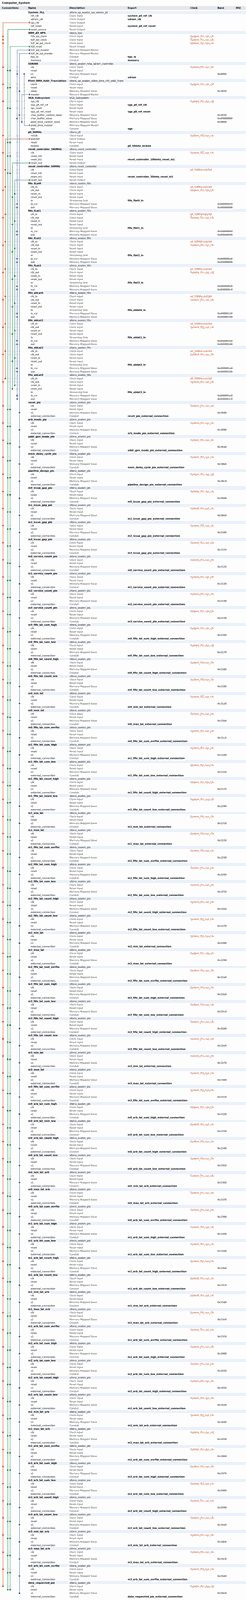
[diagram p0: system contents, whole]
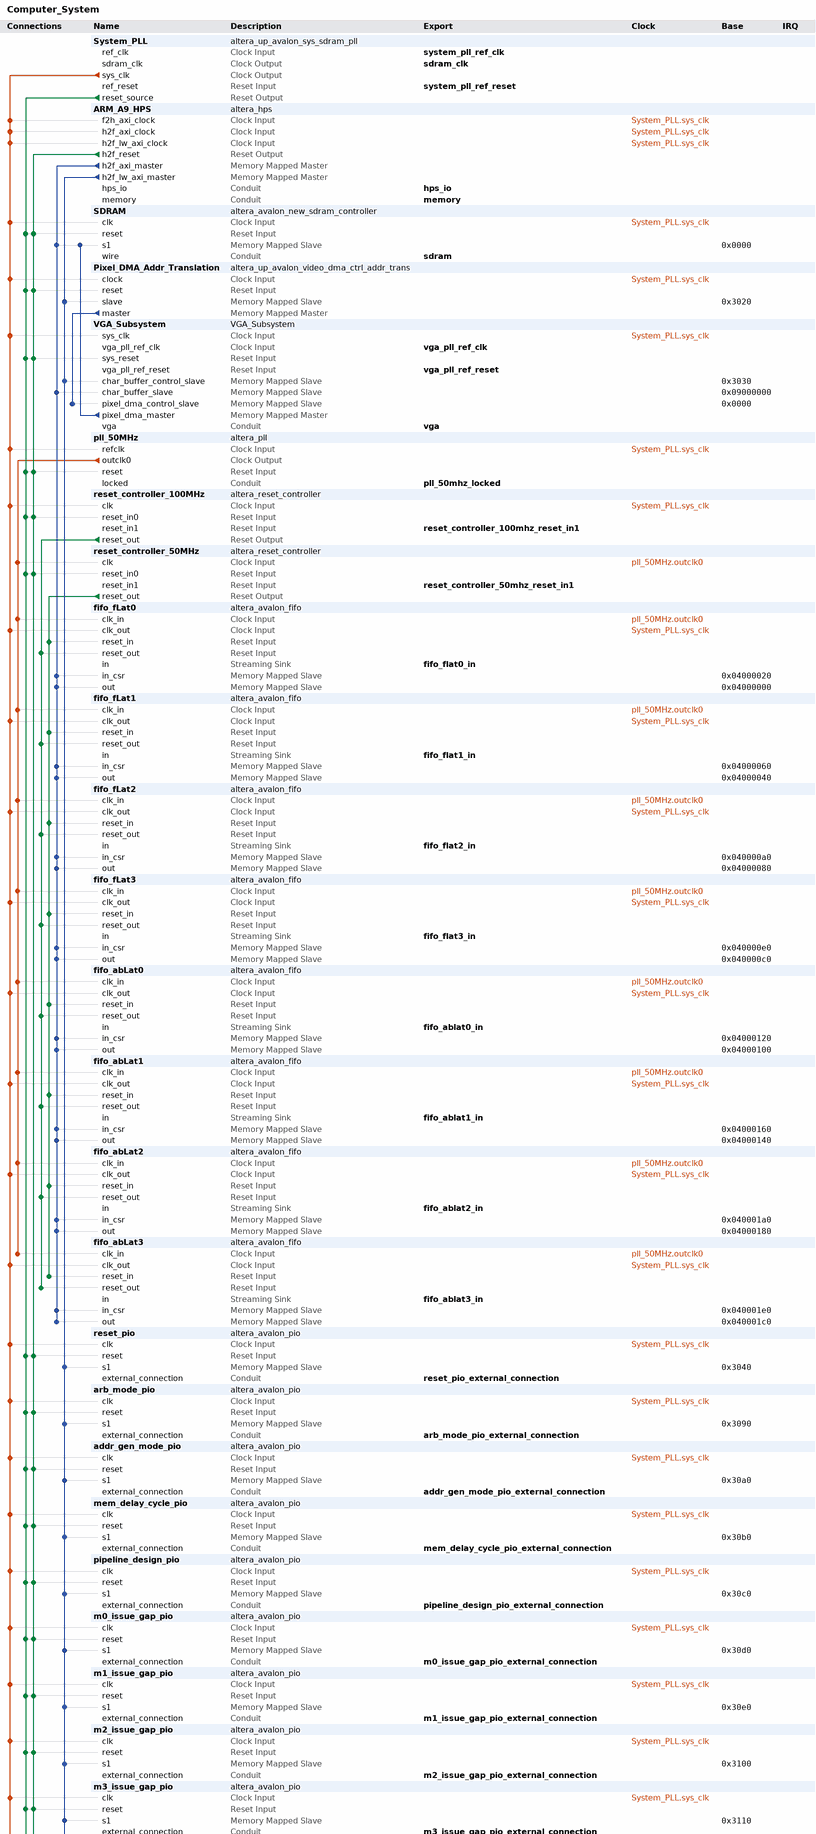
[diagram p1: system contents, upper part]
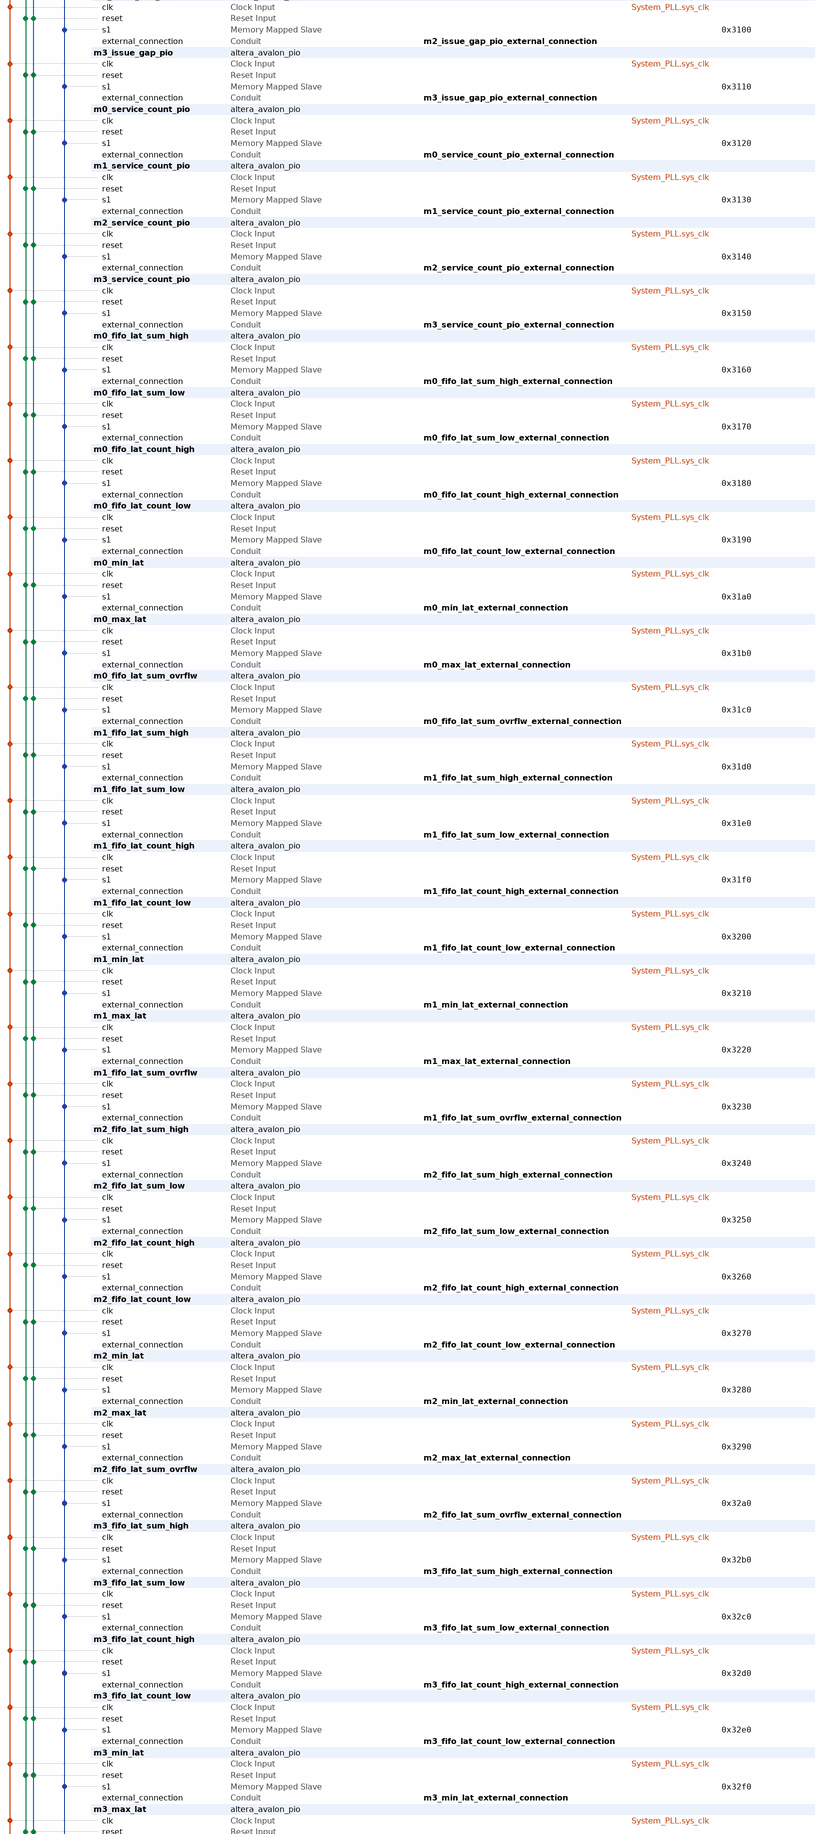
[diagram p2: system contents, middle part]
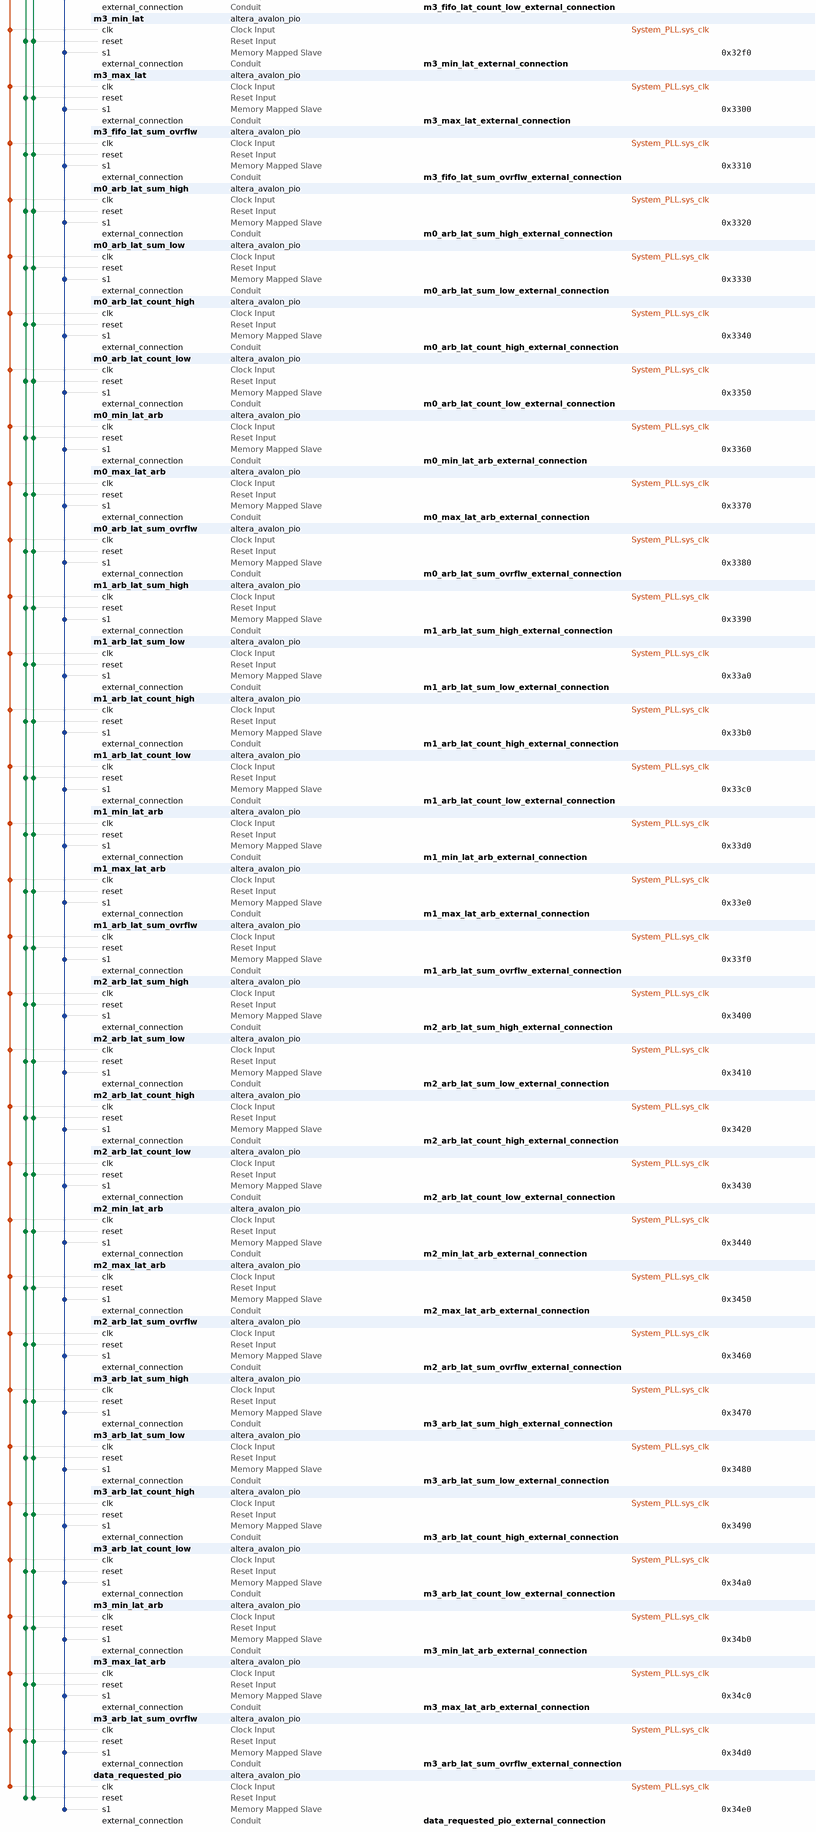
[diagram p3: system contents, lower part]
# Platform Designer (Qsys) system Computer_System, Cyclone V 5CSEMA5F31C6
# Parameters at their usual value, and those the tool derives, are not listed.
package require -exact qsys 18.1
create_system Computer_System
set_project_property DEVICE_FAMILY {Cyclone V}
set_project_property DEVICE 5CSEMA5F31C6

add_instance System_PLL altera_up_avalon_sys_sdram_pll 18.0
set_instance_parameter_value System_PLL CV_boards DE1-SoC
set_instance_parameter_value System_PLL gui_outclk 100.0
set_instance_parameter_value System_PLL gui_refclk 50.0

add_instance ARM_A9_HPS altera_hps 18.1
set_instance_parameter_value ARM_A9_HPS EMAC1_Mode RGMII
set_instance_parameter_value ARM_A9_HPS EMAC1_PinMuxing {HPS I/O Set 0}
set_instance_parameter_value ARM_A9_HPS F2SCLK_COLDRST_Enable false
set_instance_parameter_value ARM_A9_HPS F2SCLK_DBGRST_Enable false
set_instance_parameter_value ARM_A9_HPS F2SCLK_WARMRST_Enable false
set_instance_parameter_value ARM_A9_HPS F2SINTERRUPT_Enable true
set_instance_parameter_value ARM_A9_HPS F2S_Width 2
set_instance_parameter_value ARM_A9_HPS FPGA_PERIPHERAL_OUTPUT_CLOCK_FREQ_EMAC0_GTX_CLK 125
set_instance_parameter_value ARM_A9_HPS FPGA_PERIPHERAL_OUTPUT_CLOCK_FREQ_EMAC0_MD_CLK 100.0
set_instance_parameter_value ARM_A9_HPS FPGA_PERIPHERAL_OUTPUT_CLOCK_FREQ_EMAC1_GTX_CLK 125
set_instance_parameter_value ARM_A9_HPS FPGA_PERIPHERAL_OUTPUT_CLOCK_FREQ_EMAC1_MD_CLK 100.0
set_instance_parameter_value ARM_A9_HPS HPS_PROTOCOL DDR3
set_instance_parameter_value ARM_A9_HPS I2C0_Mode I2C
set_instance_parameter_value ARM_A9_HPS I2C0_PinMuxing {HPS I/O Set 0}
set_instance_parameter_value ARM_A9_HPS I2C1_Mode I2C
set_instance_parameter_value ARM_A9_HPS I2C1_PinMuxing {HPS I/O Set 0}
set_instance_parameter_value ARM_A9_HPS LWH2F_Enable true
set_instance_parameter_value ARM_A9_HPS MEM_BANKADDR_WIDTH 3
set_instance_parameter_value ARM_A9_HPS MEM_CLK_FREQ 400.0
set_instance_parameter_value ARM_A9_HPS MEM_COL_ADDR_WIDTH 10
set_instance_parameter_value ARM_A9_HPS MEM_DQ_WIDTH 32
set_instance_parameter_value ARM_A9_HPS MEM_DRV_STR RZQ/7
set_instance_parameter_value ARM_A9_HPS MEM_ROW_ADDR_WIDTH 15
set_instance_parameter_value ARM_A9_HPS MEM_RTT_NOM RZQ/4
set_instance_parameter_value ARM_A9_HPS MEM_RTT_WR RZQ/4
set_instance_parameter_value ARM_A9_HPS MEM_TCL 11
set_instance_parameter_value ARM_A9_HPS MEM_TFAW_NS 30.0
set_instance_parameter_value ARM_A9_HPS MEM_TRAS_NS 35.0
set_instance_parameter_value ARM_A9_HPS MEM_TRCD_NS 13.75
set_instance_parameter_value ARM_A9_HPS MEM_TRFC_NS 260.0
set_instance_parameter_value ARM_A9_HPS MEM_TRP_NS 13.75
set_instance_parameter_value ARM_A9_HPS MEM_VENDOR JEDEC
set_instance_parameter_value ARM_A9_HPS MEM_WTCL 8
set_instance_parameter_value ARM_A9_HPS QSPI_Mode {1 SS}
set_instance_parameter_value ARM_A9_HPS QSPI_PinMuxing {HPS I/O Set 0}
set_instance_parameter_value ARM_A9_HPS REF_CLK_FREQ 25.0
set_instance_parameter_value ARM_A9_HPS S2FCLK_USER2CLK 5
set_instance_parameter_value ARM_A9_HPS S2F_Width 3
set_instance_parameter_value ARM_A9_HPS SDIO_Mode {4-bit Data}
set_instance_parameter_value ARM_A9_HPS SDIO_PinMuxing {HPS I/O Set 0}
set_instance_parameter_value ARM_A9_HPS SPIM1_Mode {Single Slave Select}
set_instance_parameter_value ARM_A9_HPS SPIM1_PinMuxing {HPS I/O Set 0}
set_instance_parameter_value ARM_A9_HPS STM_Enable false
set_instance_parameter_value ARM_A9_HPS TIMING_BOARD_AC_SKEW 0.03
set_instance_parameter_value ARM_A9_HPS TIMING_BOARD_AC_TO_CK_SKEW 0.0
set_instance_parameter_value ARM_A9_HPS TIMING_BOARD_DQ_TO_DQS_SKEW 0.0
set_instance_parameter_value ARM_A9_HPS TIMING_BOARD_MAX_CK_DELAY 0.03
set_instance_parameter_value ARM_A9_HPS TIMING_BOARD_MAX_DQS_DELAY 0.02
set_instance_parameter_value ARM_A9_HPS TIMING_BOARD_SKEW_BETWEEN_DQS 0.08
set_instance_parameter_value ARM_A9_HPS TIMING_BOARD_SKEW_CKDQS_DIMM_MAX 0.16
set_instance_parameter_value ARM_A9_HPS TIMING_BOARD_SKEW_CKDQS_DIMM_MIN 0.09
set_instance_parameter_value ARM_A9_HPS TIMING_BOARD_SKEW_WITHIN_DQS 0.01
set_instance_parameter_value ARM_A9_HPS TIMING_TDH 65
set_instance_parameter_value ARM_A9_HPS TIMING_TDQSCK 255
set_instance_parameter_value ARM_A9_HPS TIMING_TDQSQ 125
set_instance_parameter_value ARM_A9_HPS TIMING_TDS 30
set_instance_parameter_value ARM_A9_HPS TIMING_TIH 140
set_instance_parameter_value ARM_A9_HPS TIMING_TIS 180
set_instance_parameter_value ARM_A9_HPS TIMING_TQSH 0.4
set_instance_parameter_value ARM_A9_HPS UART0_Mode {No Flow Control}
set_instance_parameter_value ARM_A9_HPS UART0_PinMuxing {HPS I/O Set 0}
set_instance_parameter_value ARM_A9_HPS USB1_Mode SDR
set_instance_parameter_value ARM_A9_HPS USB1_PinMuxing {HPS I/O Set 0}
set_instance_parameter_value ARM_A9_HPS desired_cfg_clk_mhz 100.0
set_instance_parameter_value ARM_A9_HPS desired_qspi_clk_mhz 400.0

add_instance SDRAM altera_avalon_new_sdram_controller 18.1
set_instance_parameter_value SDRAM TAC 5.5
set_instance_parameter_value SDRAM TRCD 20.0
set_instance_parameter_value SDRAM TRP 20.0
set_instance_parameter_value SDRAM casLatency 3
set_instance_parameter_value SDRAM columnWidth 10
set_instance_parameter_value SDRAM dataWidth 16
set_instance_parameter_value SDRAM generateSimulationModel true
set_instance_parameter_value SDRAM model single_Micron_MT48LC4M32B2_7_chip
set_instance_parameter_value SDRAM numberOfBanks 4
set_instance_parameter_value SDRAM numberOfChipSelects 1
set_instance_parameter_value SDRAM powerUpDelay 100.0
set_instance_parameter_value SDRAM refreshPeriod 15.625
set_instance_parameter_value SDRAM rowWidth 13

add_instance Pixel_DMA_Addr_Translation altera_up_avalon_video_dma_ctrl_addr_trans 18.0

add_instance VGA_Subsystem VGA_Subsystem 1.0

add_instance pll_50MHz altera_pll 18.1
set_instance_parameter_value pll_50MHz gui_device_speed_grade 1
set_instance_parameter_value pll_50MHz gui_number_of_clocks 1
set_instance_parameter_value pll_50MHz gui_operation_mode direct
set_instance_parameter_value pll_50MHz gui_output_clock_frequency0 50.0
set_instance_parameter_value pll_50MHz gui_pll_mode {Integer-N PLL}
set_instance_parameter_value pll_50MHz gui_reference_clock_frequency 100.0
set_instance_parameter_value pll_50MHz gui_use_locked true

add_instance reset_controller_100MHz altera_reset_controller 18.1
set_instance_parameter_value reset_controller_100MHz NUM_RESET_INPUTS 2
set_instance_parameter_value reset_controller_100MHz SYNC_DEPTH 2

add_instance reset_controller_50MHz altera_reset_controller 18.1
set_instance_parameter_value reset_controller_50MHz NUM_RESET_INPUTS 2
set_instance_parameter_value reset_controller_50MHz SYNC_DEPTH 2

add_instance fifo_fLat0 altera_avalon_fifo 18.1
set_instance_parameter_value fifo_fLat0 bitsPerSymbol 32
set_instance_parameter_value fifo_fLat0 channelWidth 0
set_instance_parameter_value fifo_fLat0 errorWidth 0
set_instance_parameter_value fifo_fLat0 fifoDepth 4096
set_instance_parameter_value fifo_fLat0 fifoInputInterfaceOptions AVALONST_SINK
set_instance_parameter_value fifo_fLat0 fifoOutputInterfaceOptions AVALONMM_READ
set_instance_parameter_value fifo_fLat0 singleClockMode false
set_instance_parameter_value fifo_fLat0 symbolsPerBeat 1
set_instance_parameter_value fifo_fLat0 useBackpressure false
set_instance_parameter_value fifo_fLat0 useIRQ false
set_instance_parameter_value fifo_fLat0 usePacket false
set_instance_parameter_value fifo_fLat0 useReadControl false

add_instance fifo_fLat1 altera_avalon_fifo 18.1
set_instance_parameter_value fifo_fLat1 bitsPerSymbol 32
set_instance_parameter_value fifo_fLat1 channelWidth 0
set_instance_parameter_value fifo_fLat1 errorWidth 0
set_instance_parameter_value fifo_fLat1 fifoDepth 4096
set_instance_parameter_value fifo_fLat1 fifoInputInterfaceOptions AVALONST_SINK
set_instance_parameter_value fifo_fLat1 fifoOutputInterfaceOptions AVALONMM_READ
set_instance_parameter_value fifo_fLat1 singleClockMode false
set_instance_parameter_value fifo_fLat1 symbolsPerBeat 1
set_instance_parameter_value fifo_fLat1 useBackpressure false
set_instance_parameter_value fifo_fLat1 useIRQ false
set_instance_parameter_value fifo_fLat1 usePacket false
set_instance_parameter_value fifo_fLat1 useReadControl false

add_instance fifo_fLat2 altera_avalon_fifo 18.1
set_instance_parameter_value fifo_fLat2 bitsPerSymbol 32
set_instance_parameter_value fifo_fLat2 channelWidth 0
set_instance_parameter_value fifo_fLat2 errorWidth 0
set_instance_parameter_value fifo_fLat2 fifoDepth 4096
set_instance_parameter_value fifo_fLat2 fifoInputInterfaceOptions AVALONST_SINK
set_instance_parameter_value fifo_fLat2 fifoOutputInterfaceOptions AVALONMM_READ
set_instance_parameter_value fifo_fLat2 singleClockMode false
set_instance_parameter_value fifo_fLat2 symbolsPerBeat 1
set_instance_parameter_value fifo_fLat2 useBackpressure false
set_instance_parameter_value fifo_fLat2 useIRQ false
set_instance_parameter_value fifo_fLat2 usePacket false
set_instance_parameter_value fifo_fLat2 useReadControl false

add_instance fifo_fLat3 altera_avalon_fifo 18.1
set_instance_parameter_value fifo_fLat3 bitsPerSymbol 32
set_instance_parameter_value fifo_fLat3 channelWidth 0
set_instance_parameter_value fifo_fLat3 errorWidth 0
set_instance_parameter_value fifo_fLat3 fifoDepth 4096
set_instance_parameter_value fifo_fLat3 fifoInputInterfaceOptions AVALONST_SINK
set_instance_parameter_value fifo_fLat3 fifoOutputInterfaceOptions AVALONMM_READ
set_instance_parameter_value fifo_fLat3 singleClockMode false
set_instance_parameter_value fifo_fLat3 symbolsPerBeat 1
set_instance_parameter_value fifo_fLat3 useBackpressure false
set_instance_parameter_value fifo_fLat3 useIRQ false
set_instance_parameter_value fifo_fLat3 usePacket false
set_instance_parameter_value fifo_fLat3 useReadControl false

add_instance fifo_abLat0 altera_avalon_fifo 18.1
set_instance_parameter_value fifo_abLat0 bitsPerSymbol 32
set_instance_parameter_value fifo_abLat0 channelWidth 0
set_instance_parameter_value fifo_abLat0 errorWidth 0
set_instance_parameter_value fifo_abLat0 fifoDepth 4096
set_instance_parameter_value fifo_abLat0 fifoInputInterfaceOptions AVALONST_SINK
set_instance_parameter_value fifo_abLat0 fifoOutputInterfaceOptions AVALONMM_READ
set_instance_parameter_value fifo_abLat0 singleClockMode false
set_instance_parameter_value fifo_abLat0 symbolsPerBeat 1
set_instance_parameter_value fifo_abLat0 useBackpressure false
set_instance_parameter_value fifo_abLat0 useIRQ false
set_instance_parameter_value fifo_abLat0 usePacket false
set_instance_parameter_value fifo_abLat0 useReadControl false

add_instance fifo_abLat1 altera_avalon_fifo 18.1
set_instance_parameter_value fifo_abLat1 bitsPerSymbol 32
set_instance_parameter_value fifo_abLat1 channelWidth 0
set_instance_parameter_value fifo_abLat1 errorWidth 0
set_instance_parameter_value fifo_abLat1 fifoDepth 4096
set_instance_parameter_value fifo_abLat1 fifoInputInterfaceOptions AVALONST_SINK
set_instance_parameter_value fifo_abLat1 fifoOutputInterfaceOptions AVALONMM_READ
set_instance_parameter_value fifo_abLat1 singleClockMode false
set_instance_parameter_value fifo_abLat1 symbolsPerBeat 1
set_instance_parameter_value fifo_abLat1 useBackpressure false
set_instance_parameter_value fifo_abLat1 useIRQ false
set_instance_parameter_value fifo_abLat1 usePacket false
set_instance_parameter_value fifo_abLat1 useReadControl false

add_instance fifo_abLat2 altera_avalon_fifo 18.1
set_instance_parameter_value fifo_abLat2 bitsPerSymbol 32
set_instance_parameter_value fifo_abLat2 channelWidth 0
set_instance_parameter_value fifo_abLat2 errorWidth 0
set_instance_parameter_value fifo_abLat2 fifoDepth 4096
set_instance_parameter_value fifo_abLat2 fifoInputInterfaceOptions AVALONST_SINK
set_instance_parameter_value fifo_abLat2 fifoOutputInterfaceOptions AVALONMM_READ
set_instance_parameter_value fifo_abLat2 singleClockMode false
set_instance_parameter_value fifo_abLat2 symbolsPerBeat 1
set_instance_parameter_value fifo_abLat2 useBackpressure false
set_instance_parameter_value fifo_abLat2 useIRQ false
set_instance_parameter_value fifo_abLat2 usePacket false
set_instance_parameter_value fifo_abLat2 useReadControl false

add_instance fifo_abLat3 altera_avalon_fifo 18.1
set_instance_parameter_value fifo_abLat3 bitsPerSymbol 32
set_instance_parameter_value fifo_abLat3 channelWidth 0
set_instance_parameter_value fifo_abLat3 errorWidth 0
set_instance_parameter_value fifo_abLat3 fifoDepth 4096
set_instance_parameter_value fifo_abLat3 fifoInputInterfaceOptions AVALONST_SINK
set_instance_parameter_value fifo_abLat3 fifoOutputInterfaceOptions AVALONMM_READ
set_instance_parameter_value fifo_abLat3 singleClockMode false
set_instance_parameter_value fifo_abLat3 symbolsPerBeat 1
set_instance_parameter_value fifo_abLat3 useBackpressure false
set_instance_parameter_value fifo_abLat3 useIRQ false
set_instance_parameter_value fifo_abLat3 usePacket false
set_instance_parameter_value fifo_abLat3 useReadControl false

add_instance reset_pio altera_avalon_pio 18.1
set_instance_parameter_value reset_pio direction Output
set_instance_parameter_value reset_pio width 32

add_instance arb_mode_pio altera_avalon_pio 18.1
set_instance_parameter_value arb_mode_pio direction Output
set_instance_parameter_value arb_mode_pio width 32

add_instance addr_gen_mode_pio altera_avalon_pio 18.1
set_instance_parameter_value addr_gen_mode_pio direction Output
set_instance_parameter_value addr_gen_mode_pio width 32

add_instance mem_delay_cycle_pio altera_avalon_pio 18.1
set_instance_parameter_value mem_delay_cycle_pio direction Output
set_instance_parameter_value mem_delay_cycle_pio width 32

add_instance pipeline_design_pio altera_avalon_pio 18.1
set_instance_parameter_value pipeline_design_pio direction Output
set_instance_parameter_value pipeline_design_pio width 32

add_instance m0_issue_gap_pio altera_avalon_pio 18.1
set_instance_parameter_value m0_issue_gap_pio direction Output
set_instance_parameter_value m0_issue_gap_pio width 32

add_instance m1_issue_gap_pio altera_avalon_pio 18.1
set_instance_parameter_value m1_issue_gap_pio direction Output
set_instance_parameter_value m1_issue_gap_pio width 32

add_instance m2_issue_gap_pio altera_avalon_pio 18.1
set_instance_parameter_value m2_issue_gap_pio direction Output
set_instance_parameter_value m2_issue_gap_pio width 32

add_instance m3_issue_gap_pio altera_avalon_pio 18.1
set_instance_parameter_value m3_issue_gap_pio direction Output
set_instance_parameter_value m3_issue_gap_pio width 32

add_instance m0_service_count_pio altera_avalon_pio 18.1
set_instance_parameter_value m0_service_count_pio direction Input
set_instance_parameter_value m0_service_count_pio width 32

add_instance m1_service_count_pio altera_avalon_pio 18.1
set_instance_parameter_value m1_service_count_pio direction Input
set_instance_parameter_value m1_service_count_pio width 32

add_instance m2_service_count_pio altera_avalon_pio 18.1
set_instance_parameter_value m2_service_count_pio direction Input
set_instance_parameter_value m2_service_count_pio width 32

add_instance m3_service_count_pio altera_avalon_pio 18.1
set_instance_parameter_value m3_service_count_pio direction Input
set_instance_parameter_value m3_service_count_pio width 32

add_instance m0_fifo_lat_sum_high altera_avalon_pio 18.1
set_instance_parameter_value m0_fifo_lat_sum_high direction Input
set_instance_parameter_value m0_fifo_lat_sum_high width 32

add_instance m0_fifo_lat_sum_low altera_avalon_pio 18.1
set_instance_parameter_value m0_fifo_lat_sum_low direction Input
set_instance_parameter_value m0_fifo_lat_sum_low width 32

add_instance m0_fifo_lat_count_high altera_avalon_pio 18.1
set_instance_parameter_value m0_fifo_lat_count_high direction Input
set_instance_parameter_value m0_fifo_lat_count_high width 32

add_instance m0_fifo_lat_count_low altera_avalon_pio 18.1
set_instance_parameter_value m0_fifo_lat_count_low direction Input
set_instance_parameter_value m0_fifo_lat_count_low width 32

add_instance m0_min_lat altera_avalon_pio 18.1
set_instance_parameter_value m0_min_lat direction Input
set_instance_parameter_value m0_min_lat width 32

add_instance m0_max_lat altera_avalon_pio 18.1
set_instance_parameter_value m0_max_lat direction Input
set_instance_parameter_value m0_max_lat width 32

add_instance m0_fifo_lat_sum_ovrflw altera_avalon_pio 18.1
set_instance_parameter_value m0_fifo_lat_sum_ovrflw direction Input
set_instance_parameter_value m0_fifo_lat_sum_ovrflw width 32

add_instance m1_fifo_lat_sum_high altera_avalon_pio 18.1
set_instance_parameter_value m1_fifo_lat_sum_high direction Input
set_instance_parameter_value m1_fifo_lat_sum_high width 32

add_instance m1_fifo_lat_sum_low altera_avalon_pio 18.1
set_instance_parameter_value m1_fifo_lat_sum_low direction Input
set_instance_parameter_value m1_fifo_lat_sum_low width 32

add_instance m1_fifo_lat_count_high altera_avalon_pio 18.1
set_instance_parameter_value m1_fifo_lat_count_high direction Input
set_instance_parameter_value m1_fifo_lat_count_high width 32

add_instance m1_fifo_lat_count_low altera_avalon_pio 18.1
set_instance_parameter_value m1_fifo_lat_count_low direction Input
set_instance_parameter_value m1_fifo_lat_count_low width 32

add_instance m1_min_lat altera_avalon_pio 18.1
set_instance_parameter_value m1_min_lat direction Input
set_instance_parameter_value m1_min_lat width 32

add_instance m1_max_lat altera_avalon_pio 18.1
set_instance_parameter_value m1_max_lat direction Input
set_instance_parameter_value m1_max_lat width 32

add_instance m1_fifo_lat_sum_ovrflw altera_avalon_pio 18.1
set_instance_parameter_value m1_fifo_lat_sum_ovrflw direction Input
set_instance_parameter_value m1_fifo_lat_sum_ovrflw width 32

add_instance m2_fifo_lat_sum_high altera_avalon_pio 18.1
set_instance_parameter_value m2_fifo_lat_sum_high direction Input
set_instance_parameter_value m2_fifo_lat_sum_high width 32

add_instance m2_fifo_lat_sum_low altera_avalon_pio 18.1
set_instance_parameter_value m2_fifo_lat_sum_low direction Input
set_instance_parameter_value m2_fifo_lat_sum_low width 32

add_instance m2_fifo_lat_count_high altera_avalon_pio 18.1
set_instance_parameter_value m2_fifo_lat_count_high direction Input
set_instance_parameter_value m2_fifo_lat_count_high width 32

add_instance m2_fifo_lat_count_low altera_avalon_pio 18.1
set_instance_parameter_value m2_fifo_lat_count_low direction Input
set_instance_parameter_value m2_fifo_lat_count_low width 32

add_instance m2_min_lat altera_avalon_pio 18.1
set_instance_parameter_value m2_min_lat direction Input
set_instance_parameter_value m2_min_lat width 32

add_instance m2_max_lat altera_avalon_pio 18.1
set_instance_parameter_value m2_max_lat direction Input
set_instance_parameter_value m2_max_lat width 32

add_instance m2_fifo_lat_sum_ovrflw altera_avalon_pio 18.1
set_instance_parameter_value m2_fifo_lat_sum_ovrflw direction Input
set_instance_parameter_value m2_fifo_lat_sum_ovrflw width 32

add_instance m3_fifo_lat_sum_high altera_avalon_pio 18.1
set_instance_parameter_value m3_fifo_lat_sum_high direction Input
set_instance_parameter_value m3_fifo_lat_sum_high width 32

add_instance m3_fifo_lat_sum_low altera_avalon_pio 18.1
set_instance_parameter_value m3_fifo_lat_sum_low direction Input
set_instance_parameter_value m3_fifo_lat_sum_low width 32

add_instance m3_fifo_lat_count_high altera_avalon_pio 18.1
set_instance_parameter_value m3_fifo_lat_count_high direction Input
set_instance_parameter_value m3_fifo_lat_count_high width 32

add_instance m3_fifo_lat_count_low altera_avalon_pio 18.1
set_instance_parameter_value m3_fifo_lat_count_low direction Input
set_instance_parameter_value m3_fifo_lat_count_low width 32

add_instance m3_min_lat altera_avalon_pio 18.1
set_instance_parameter_value m3_min_lat direction Input
set_instance_parameter_value m3_min_lat width 32

add_instance m3_max_lat altera_avalon_pio 18.1
set_instance_parameter_value m3_max_lat direction Input
set_instance_parameter_value m3_max_lat width 32

add_instance m3_fifo_lat_sum_ovrflw altera_avalon_pio 18.1
set_instance_parameter_value m3_fifo_lat_sum_ovrflw direction Input
set_instance_parameter_value m3_fifo_lat_sum_ovrflw width 32

add_instance m0_arb_lat_sum_high altera_avalon_pio 18.1
set_instance_parameter_value m0_arb_lat_sum_high direction Input
set_instance_parameter_value m0_arb_lat_sum_high width 32

add_instance m0_arb_lat_sum_low altera_avalon_pio 18.1
set_instance_parameter_value m0_arb_lat_sum_low direction Input
set_instance_parameter_value m0_arb_lat_sum_low width 32

add_instance m0_arb_lat_count_high altera_avalon_pio 18.1
set_instance_parameter_value m0_arb_lat_count_high direction Input
set_instance_parameter_value m0_arb_lat_count_high width 32

add_instance m0_arb_lat_count_low altera_avalon_pio 18.1
set_instance_parameter_value m0_arb_lat_count_low direction Input
set_instance_parameter_value m0_arb_lat_count_low width 32

add_instance m0_min_lat_arb altera_avalon_pio 18.1
set_instance_parameter_value m0_min_lat_arb direction Input
set_instance_parameter_value m0_min_lat_arb width 32

add_instance m0_max_lat_arb altera_avalon_pio 18.1
set_instance_parameter_value m0_max_lat_arb direction Input
set_instance_parameter_value m0_max_lat_arb width 32

add_instance m0_arb_lat_sum_ovrflw altera_avalon_pio 18.1
set_instance_parameter_value m0_arb_lat_sum_ovrflw direction Input
set_instance_parameter_value m0_arb_lat_sum_ovrflw width 32

add_instance m1_arb_lat_sum_high altera_avalon_pio 18.1
set_instance_parameter_value m1_arb_lat_sum_high direction Input
set_instance_parameter_value m1_arb_lat_sum_high width 32

add_instance m1_arb_lat_sum_low altera_avalon_pio 18.1
set_instance_parameter_value m1_arb_lat_sum_low direction Input
set_instance_parameter_value m1_arb_lat_sum_low width 32

add_instance m1_arb_lat_count_high altera_avalon_pio 18.1
set_instance_parameter_value m1_arb_lat_count_high direction Input
set_instance_parameter_value m1_arb_lat_count_high width 32

add_instance m1_arb_lat_count_low altera_avalon_pio 18.1
set_instance_parameter_value m1_arb_lat_count_low direction Input
set_instance_parameter_value m1_arb_lat_count_low width 32

add_instance m1_min_lat_arb altera_avalon_pio 18.1
set_instance_parameter_value m1_min_lat_arb direction Input
set_instance_parameter_value m1_min_lat_arb width 32

add_instance m1_max_lat_arb altera_avalon_pio 18.1
set_instance_parameter_value m1_max_lat_arb direction Input
set_instance_parameter_value m1_max_lat_arb width 32

add_instance m1_arb_lat_sum_ovrflw altera_avalon_pio 18.1
set_instance_parameter_value m1_arb_lat_sum_ovrflw direction Input
set_instance_parameter_value m1_arb_lat_sum_ovrflw width 32

add_instance m2_arb_lat_sum_high altera_avalon_pio 18.1
set_instance_parameter_value m2_arb_lat_sum_high direction Input
set_instance_parameter_value m2_arb_lat_sum_high width 32

add_instance m2_arb_lat_sum_low altera_avalon_pio 18.1
set_instance_parameter_value m2_arb_lat_sum_low direction Input
set_instance_parameter_value m2_arb_lat_sum_low width 32

add_instance m2_arb_lat_count_high altera_avalon_pio 18.1
set_instance_parameter_value m2_arb_lat_count_high direction Input
set_instance_parameter_value m2_arb_lat_count_high width 32

add_instance m2_arb_lat_count_low altera_avalon_pio 18.1
set_instance_parameter_value m2_arb_lat_count_low direction Input
set_instance_parameter_value m2_arb_lat_count_low width 32

add_instance m2_min_lat_arb altera_avalon_pio 18.1
set_instance_parameter_value m2_min_lat_arb direction Input
set_instance_parameter_value m2_min_lat_arb width 32

add_instance m2_max_lat_arb altera_avalon_pio 18.1
set_instance_parameter_value m2_max_lat_arb direction Input
set_instance_parameter_value m2_max_lat_arb width 32

add_instance m2_arb_lat_sum_ovrflw altera_avalon_pio 18.1
set_instance_parameter_value m2_arb_lat_sum_ovrflw direction Input
set_instance_parameter_value m2_arb_lat_sum_ovrflw width 32

add_instance m3_arb_lat_sum_high altera_avalon_pio 18.1
set_instance_parameter_value m3_arb_lat_sum_high direction Input
set_instance_parameter_value m3_arb_lat_sum_high width 32

add_instance m3_arb_lat_sum_low altera_avalon_pio 18.1
set_instance_parameter_value m3_arb_lat_sum_low direction Input
set_instance_parameter_value m3_arb_lat_sum_low width 32

add_instance m3_arb_lat_count_high altera_avalon_pio 18.1
set_instance_parameter_value m3_arb_lat_count_high direction Input
set_instance_parameter_value m3_arb_lat_count_high width 32

add_instance m3_arb_lat_count_low altera_avalon_pio 18.1
set_instance_parameter_value m3_arb_lat_count_low direction Input
set_instance_parameter_value m3_arb_lat_count_low width 32

add_instance m3_min_lat_arb altera_avalon_pio 18.1
set_instance_parameter_value m3_min_lat_arb direction Input
set_instance_parameter_value m3_min_lat_arb width 32

add_instance m3_max_lat_arb altera_avalon_pio 18.1
set_instance_parameter_value m3_max_lat_arb direction Input
set_instance_parameter_value m3_max_lat_arb width 32

add_instance m3_arb_lat_sum_ovrflw altera_avalon_pio 18.1
set_instance_parameter_value m3_arb_lat_sum_ovrflw direction Input
set_instance_parameter_value m3_arb_lat_sum_ovrflw width 32

add_instance data_requested_pio altera_avalon_pio 18.1
set_instance_parameter_value data_requested_pio direction Output
set_instance_parameter_value data_requested_pio width 32

# connections
add_connection pll_50MHz.outclk0 fifo_abLat0.clk_in clock
add_connection pll_50MHz.outclk0 fifo_abLat1.clk_in clock
add_connection pll_50MHz.outclk0 fifo_abLat2.clk_in clock
add_connection pll_50MHz.outclk0 fifo_abLat3.clk_in clock
add_connection pll_50MHz.outclk0 fifo_fLat0.clk_in clock
add_connection pll_50MHz.outclk0 fifo_fLat1.clk_in clock
add_connection pll_50MHz.outclk0 fifo_fLat2.clk_in clock
add_connection pll_50MHz.outclk0 fifo_fLat3.clk_in clock
add_connection pll_50MHz.outclk0 reset_controller_50MHz.clk clock
add_connection System_PLL.sys_clk addr_gen_mode_pio.clk clock
add_connection System_PLL.sys_clk arb_mode_pio.clk clock
add_connection System_PLL.sys_clk ARM_A9_HPS.f2h_axi_clock clock
add_connection System_PLL.sys_clk ARM_A9_HPS.h2f_axi_clock clock
add_connection System_PLL.sys_clk ARM_A9_HPS.h2f_lw_axi_clock clock
add_connection System_PLL.sys_clk data_requested_pio.clk clock
add_connection System_PLL.sys_clk fifo_abLat0.clk_out clock
add_connection System_PLL.sys_clk fifo_abLat1.clk_out clock
add_connection System_PLL.sys_clk fifo_abLat2.clk_out clock
add_connection System_PLL.sys_clk fifo_abLat3.clk_out clock
add_connection System_PLL.sys_clk fifo_fLat0.clk_out clock
add_connection System_PLL.sys_clk fifo_fLat1.clk_out clock
add_connection System_PLL.sys_clk fifo_fLat2.clk_out clock
add_connection System_PLL.sys_clk fifo_fLat3.clk_out clock
add_connection System_PLL.sys_clk m0_arb_lat_count_high.clk clock
add_connection System_PLL.sys_clk m0_arb_lat_count_low.clk clock
add_connection System_PLL.sys_clk m0_arb_lat_sum_high.clk clock
add_connection System_PLL.sys_clk m0_arb_lat_sum_low.clk clock
add_connection System_PLL.sys_clk m0_arb_lat_sum_ovrflw.clk clock
add_connection System_PLL.sys_clk m0_fifo_lat_count_high.clk clock
add_connection System_PLL.sys_clk m0_fifo_lat_count_low.clk clock
add_connection System_PLL.sys_clk m0_fifo_lat_sum_high.clk clock
add_connection System_PLL.sys_clk m0_fifo_lat_sum_low.clk clock
add_connection System_PLL.sys_clk m0_fifo_lat_sum_ovrflw.clk clock
add_connection System_PLL.sys_clk m0_issue_gap_pio.clk clock
add_connection System_PLL.sys_clk m0_max_lat.clk clock
add_connection System_PLL.sys_clk m0_max_lat_arb.clk clock
add_connection System_PLL.sys_clk m0_min_lat.clk clock
add_connection System_PLL.sys_clk m0_min_lat_arb.clk clock
add_connection System_PLL.sys_clk m0_service_count_pio.clk clock
add_connection System_PLL.sys_clk m1_arb_lat_count_high.clk clock
add_connection System_PLL.sys_clk m1_arb_lat_count_low.clk clock
add_connection System_PLL.sys_clk m1_arb_lat_sum_high.clk clock
add_connection System_PLL.sys_clk m1_arb_lat_sum_low.clk clock
add_connection System_PLL.sys_clk m1_arb_lat_sum_ovrflw.clk clock
add_connection System_PLL.sys_clk m1_fifo_lat_count_high.clk clock
add_connection System_PLL.sys_clk m1_fifo_lat_count_low.clk clock
add_connection System_PLL.sys_clk m1_fifo_lat_sum_high.clk clock
add_connection System_PLL.sys_clk m1_fifo_lat_sum_low.clk clock
add_connection System_PLL.sys_clk m1_fifo_lat_sum_ovrflw.clk clock
add_connection System_PLL.sys_clk m1_issue_gap_pio.clk clock
add_connection System_PLL.sys_clk m1_max_lat.clk clock
add_connection System_PLL.sys_clk m1_max_lat_arb.clk clock
add_connection System_PLL.sys_clk m1_min_lat.clk clock
add_connection System_PLL.sys_clk m1_min_lat_arb.clk clock
add_connection System_PLL.sys_clk m1_service_count_pio.clk clock
add_connection System_PLL.sys_clk m2_arb_lat_count_high.clk clock
add_connection System_PLL.sys_clk m2_arb_lat_count_low.clk clock
add_connection System_PLL.sys_clk m2_arb_lat_sum_high.clk clock
add_connection System_PLL.sys_clk m2_arb_lat_sum_low.clk clock
add_connection System_PLL.sys_clk m2_arb_lat_sum_ovrflw.clk clock
add_connection System_PLL.sys_clk m2_fifo_lat_count_high.clk clock
add_connection System_PLL.sys_clk m2_fifo_lat_count_low.clk clock
add_connection System_PLL.sys_clk m2_fifo_lat_sum_high.clk clock
add_connection System_PLL.sys_clk m2_fifo_lat_sum_low.clk clock
add_connection System_PLL.sys_clk m2_fifo_lat_sum_ovrflw.clk clock
add_connection System_PLL.sys_clk m2_issue_gap_pio.clk clock
add_connection System_PLL.sys_clk m2_max_lat.clk clock
add_connection System_PLL.sys_clk m2_max_lat_arb.clk clock
add_connection System_PLL.sys_clk m2_min_lat.clk clock
add_connection System_PLL.sys_clk m2_min_lat_arb.clk clock
add_connection System_PLL.sys_clk m2_service_count_pio.clk clock
add_connection System_PLL.sys_clk m3_arb_lat_count_high.clk clock
add_connection System_PLL.sys_clk m3_arb_lat_count_low.clk clock
add_connection System_PLL.sys_clk m3_arb_lat_sum_high.clk clock
add_connection System_PLL.sys_clk m3_arb_lat_sum_low.clk clock
add_connection System_PLL.sys_clk m3_arb_lat_sum_ovrflw.clk clock
add_connection System_PLL.sys_clk m3_fifo_lat_count_high.clk clock
add_connection System_PLL.sys_clk m3_fifo_lat_count_low.clk clock
add_connection System_PLL.sys_clk m3_fifo_lat_sum_high.clk clock
add_connection System_PLL.sys_clk m3_fifo_lat_sum_low.clk clock
add_connection System_PLL.sys_clk m3_fifo_lat_sum_ovrflw.clk clock
add_connection System_PLL.sys_clk m3_issue_gap_pio.clk clock
add_connection System_PLL.sys_clk m3_max_lat.clk clock
add_connection System_PLL.sys_clk m3_max_lat_arb.clk clock
add_connection System_PLL.sys_clk m3_min_lat.clk clock
add_connection System_PLL.sys_clk m3_min_lat_arb.clk clock
add_connection System_PLL.sys_clk m3_service_count_pio.clk clock
add_connection System_PLL.sys_clk mem_delay_cycle_pio.clk clock
add_connection System_PLL.sys_clk pipeline_design_pio.clk clock
add_connection System_PLL.sys_clk Pixel_DMA_Addr_Translation.clock clock
add_connection System_PLL.sys_clk pll_50MHz.refclk clock
add_connection System_PLL.sys_clk reset_controller_100MHz.clk clock
add_connection System_PLL.sys_clk reset_pio.clk clock
add_connection System_PLL.sys_clk SDRAM.clk clock
add_connection System_PLL.sys_clk VGA_Subsystem.sys_clk clock
add_connection ARM_A9_HPS.h2f_reset addr_gen_mode_pio.reset reset
add_connection ARM_A9_HPS.h2f_reset arb_mode_pio.reset reset
add_connection ARM_A9_HPS.h2f_reset data_requested_pio.reset reset
add_connection ARM_A9_HPS.h2f_reset m0_arb_lat_count_high.reset reset
add_connection ARM_A9_HPS.h2f_reset m0_arb_lat_count_low.reset reset
add_connection ARM_A9_HPS.h2f_reset m0_arb_lat_sum_high.reset reset
add_connection ARM_A9_HPS.h2f_reset m0_arb_lat_sum_low.reset reset
add_connection ARM_A9_HPS.h2f_reset m0_arb_lat_sum_ovrflw.reset reset
add_connection ARM_A9_HPS.h2f_reset m0_fifo_lat_count_high.reset reset
add_connection ARM_A9_HPS.h2f_reset m0_fifo_lat_count_low.reset reset
add_connection ARM_A9_HPS.h2f_reset m0_fifo_lat_sum_high.reset reset
add_connection ARM_A9_HPS.h2f_reset m0_fifo_lat_sum_low.reset reset
add_connection ARM_A9_HPS.h2f_reset m0_fifo_lat_sum_ovrflw.reset reset
add_connection ARM_A9_HPS.h2f_reset m0_issue_gap_pio.reset reset
add_connection ARM_A9_HPS.h2f_reset m0_max_lat.reset reset
add_connection ARM_A9_HPS.h2f_reset m0_max_lat_arb.reset reset
add_connection ARM_A9_HPS.h2f_reset m0_min_lat.reset reset
add_connection ARM_A9_HPS.h2f_reset m0_min_lat_arb.reset reset
add_connection ARM_A9_HPS.h2f_reset m0_service_count_pio.reset reset
add_connection ARM_A9_HPS.h2f_reset m1_arb_lat_count_high.reset reset
add_connection ARM_A9_HPS.h2f_reset m1_arb_lat_count_low.reset reset
add_connection ARM_A9_HPS.h2f_reset m1_arb_lat_sum_high.reset reset
add_connection ARM_A9_HPS.h2f_reset m1_arb_lat_sum_low.reset reset
add_connection ARM_A9_HPS.h2f_reset m1_arb_lat_sum_ovrflw.reset reset
add_connection ARM_A9_HPS.h2f_reset m1_fifo_lat_count_high.reset reset
add_connection ARM_A9_HPS.h2f_reset m1_fifo_lat_count_low.reset reset
add_connection ARM_A9_HPS.h2f_reset m1_fifo_lat_sum_high.reset reset
add_connection ARM_A9_HPS.h2f_reset m1_fifo_lat_sum_low.reset reset
add_connection ARM_A9_HPS.h2f_reset m1_fifo_lat_sum_ovrflw.reset reset
add_connection ARM_A9_HPS.h2f_reset m1_issue_gap_pio.reset reset
add_connection ARM_A9_HPS.h2f_reset m1_max_lat.reset reset
add_connection ARM_A9_HPS.h2f_reset m1_max_lat_arb.reset reset
add_connection ARM_A9_HPS.h2f_reset m1_min_lat.reset reset
add_connection ARM_A9_HPS.h2f_reset m1_min_lat_arb.reset reset
add_connection ARM_A9_HPS.h2f_reset m1_service_count_pio.reset reset
add_connection ARM_A9_HPS.h2f_reset m2_arb_lat_count_high.reset reset
add_connection ARM_A9_HPS.h2f_reset m2_arb_lat_count_low.reset reset
add_connection ARM_A9_HPS.h2f_reset m2_arb_lat_sum_high.reset reset
add_connection ARM_A9_HPS.h2f_reset m2_arb_lat_sum_low.reset reset
add_connection ARM_A9_HPS.h2f_reset m2_arb_lat_sum_ovrflw.reset reset
add_connection ARM_A9_HPS.h2f_reset m2_fifo_lat_count_high.reset reset
add_connection ARM_A9_HPS.h2f_reset m2_fifo_lat_count_low.reset reset
add_connection ARM_A9_HPS.h2f_reset m2_fifo_lat_sum_high.reset reset
add_connection ARM_A9_HPS.h2f_reset m2_fifo_lat_sum_low.reset reset
add_connection ARM_A9_HPS.h2f_reset m2_fifo_lat_sum_ovrflw.reset reset
add_connection ARM_A9_HPS.h2f_reset m2_issue_gap_pio.reset reset
add_connection ARM_A9_HPS.h2f_reset m2_max_lat.reset reset
add_connection ARM_A9_HPS.h2f_reset m2_max_lat_arb.reset reset
add_connection ARM_A9_HPS.h2f_reset m2_min_lat.reset reset
add_connection ARM_A9_HPS.h2f_reset m2_min_lat_arb.reset reset
add_connection ARM_A9_HPS.h2f_reset m2_service_count_pio.reset reset
add_connection ARM_A9_HPS.h2f_reset m3_arb_lat_count_high.reset reset
add_connection ARM_A9_HPS.h2f_reset m3_arb_lat_count_low.reset reset
add_connection ARM_A9_HPS.h2f_reset m3_arb_lat_sum_high.reset reset
add_connection ARM_A9_HPS.h2f_reset m3_arb_lat_sum_low.reset reset
add_connection ARM_A9_HPS.h2f_reset m3_arb_lat_sum_ovrflw.reset reset
add_connection ARM_A9_HPS.h2f_reset m3_fifo_lat_count_high.reset reset
add_connection ARM_A9_HPS.h2f_reset m3_fifo_lat_count_low.reset reset
add_connection ARM_A9_HPS.h2f_reset m3_fifo_lat_sum_high.reset reset
add_connection ARM_A9_HPS.h2f_reset m3_fifo_lat_sum_low.reset reset
add_connection ARM_A9_HPS.h2f_reset m3_fifo_lat_sum_ovrflw.reset reset
add_connection ARM_A9_HPS.h2f_reset m3_issue_gap_pio.reset reset
add_connection ARM_A9_HPS.h2f_reset m3_max_lat.reset reset
add_connection ARM_A9_HPS.h2f_reset m3_max_lat_arb.reset reset
add_connection ARM_A9_HPS.h2f_reset m3_min_lat.reset reset
add_connection ARM_A9_HPS.h2f_reset m3_min_lat_arb.reset reset
add_connection ARM_A9_HPS.h2f_reset m3_service_count_pio.reset reset
add_connection ARM_A9_HPS.h2f_reset mem_delay_cycle_pio.reset reset
add_connection ARM_A9_HPS.h2f_reset pipeline_design_pio.reset reset
add_connection ARM_A9_HPS.h2f_reset Pixel_DMA_Addr_Translation.reset reset
add_connection ARM_A9_HPS.h2f_reset pll_50MHz.reset reset
add_connection ARM_A9_HPS.h2f_reset reset_controller_50MHz.reset_in0 reset
add_connection ARM_A9_HPS.h2f_reset reset_controller_100MHz.reset_in0 reset
add_connection ARM_A9_HPS.h2f_reset reset_pio.reset reset
add_connection ARM_A9_HPS.h2f_reset SDRAM.reset reset
add_connection ARM_A9_HPS.h2f_reset VGA_Subsystem.sys_reset reset
add_connection reset_controller_50MHz.reset_out fifo_abLat0.reset_in reset
add_connection reset_controller_50MHz.reset_out fifo_abLat1.reset_in reset
add_connection reset_controller_50MHz.reset_out fifo_abLat2.reset_in reset
add_connection reset_controller_50MHz.reset_out fifo_abLat3.reset_in reset
add_connection reset_controller_50MHz.reset_out fifo_fLat0.reset_in reset
add_connection reset_controller_50MHz.reset_out fifo_fLat1.reset_in reset
add_connection reset_controller_50MHz.reset_out fifo_fLat2.reset_in reset
add_connection reset_controller_50MHz.reset_out fifo_fLat3.reset_in reset
add_connection reset_controller_100MHz.reset_out fifo_abLat0.reset_out reset
add_connection reset_controller_100MHz.reset_out fifo_abLat1.reset_out reset
add_connection reset_controller_100MHz.reset_out fifo_abLat2.reset_out reset
add_connection reset_controller_100MHz.reset_out fifo_abLat3.reset_out reset
add_connection reset_controller_100MHz.reset_out fifo_fLat0.reset_out reset
add_connection reset_controller_100MHz.reset_out fifo_fLat1.reset_out reset
add_connection reset_controller_100MHz.reset_out fifo_fLat2.reset_out reset
add_connection reset_controller_100MHz.reset_out fifo_fLat3.reset_out reset
add_connection System_PLL.reset_source addr_gen_mode_pio.reset reset
add_connection System_PLL.reset_source arb_mode_pio.reset reset
add_connection System_PLL.reset_source data_requested_pio.reset reset
add_connection System_PLL.reset_source m0_arb_lat_count_high.reset reset
add_connection System_PLL.reset_source m0_arb_lat_count_low.reset reset
add_connection System_PLL.reset_source m0_arb_lat_sum_high.reset reset
add_connection System_PLL.reset_source m0_arb_lat_sum_low.reset reset
add_connection System_PLL.reset_source m0_arb_lat_sum_ovrflw.reset reset
add_connection System_PLL.reset_source m0_fifo_lat_count_high.reset reset
add_connection System_PLL.reset_source m0_fifo_lat_count_low.reset reset
add_connection System_PLL.reset_source m0_fifo_lat_sum_high.reset reset
add_connection System_PLL.reset_source m0_fifo_lat_sum_low.reset reset
add_connection System_PLL.reset_source m0_fifo_lat_sum_ovrflw.reset reset
add_connection System_PLL.reset_source m0_issue_gap_pio.reset reset
add_connection System_PLL.reset_source m0_max_lat.reset reset
add_connection System_PLL.reset_source m0_max_lat_arb.reset reset
add_connection System_PLL.reset_source m0_min_lat.reset reset
add_connection System_PLL.reset_source m0_min_lat_arb.reset reset
add_connection System_PLL.reset_source m0_service_count_pio.reset reset
add_connection System_PLL.reset_source m1_arb_lat_count_high.reset reset
add_connection System_PLL.reset_source m1_arb_lat_count_low.reset reset
add_connection System_PLL.reset_source m1_arb_lat_sum_high.reset reset
add_connection System_PLL.reset_source m1_arb_lat_sum_low.reset reset
add_connection System_PLL.reset_source m1_arb_lat_sum_ovrflw.reset reset
add_connection System_PLL.reset_source m1_fifo_lat_count_high.reset reset
add_connection System_PLL.reset_source m1_fifo_lat_count_low.reset reset
add_connection System_PLL.reset_source m1_fifo_lat_sum_high.reset reset
add_connection System_PLL.reset_source m1_fifo_lat_sum_low.reset reset
add_connection System_PLL.reset_source m1_fifo_lat_sum_ovrflw.reset reset
add_connection System_PLL.reset_source m1_issue_gap_pio.reset reset
add_connection System_PLL.reset_source m1_max_lat.reset reset
add_connection System_PLL.reset_source m1_max_lat_arb.reset reset
add_connection System_PLL.reset_source m1_min_lat.reset reset
add_connection System_PLL.reset_source m1_min_lat_arb.reset reset
add_connection System_PLL.reset_source m1_service_count_pio.reset reset
add_connection System_PLL.reset_source m2_arb_lat_count_high.reset reset
add_connection System_PLL.reset_source m2_arb_lat_count_low.reset reset
add_connection System_PLL.reset_source m2_arb_lat_sum_high.reset reset
add_connection System_PLL.reset_source m2_arb_lat_sum_low.reset reset
add_connection System_PLL.reset_source m2_arb_lat_sum_ovrflw.reset reset
add_connection System_PLL.reset_source m2_fifo_lat_count_high.reset reset
add_connection System_PLL.reset_source m2_fifo_lat_count_low.reset reset
add_connection System_PLL.reset_source m2_fifo_lat_sum_high.reset reset
add_connection System_PLL.reset_source m2_fifo_lat_sum_low.reset reset
add_connection System_PLL.reset_source m2_fifo_lat_sum_ovrflw.reset reset
add_connection System_PLL.reset_source m2_issue_gap_pio.reset reset
add_connection System_PLL.reset_source m2_max_lat.reset reset
add_connection System_PLL.reset_source m2_max_lat_arb.reset reset
add_connection System_PLL.reset_source m2_min_lat.reset reset
add_connection System_PLL.reset_source m2_min_lat_arb.reset reset
add_connection System_PLL.reset_source m2_service_count_pio.reset reset
add_connection System_PLL.reset_source m3_arb_lat_count_high.reset reset
add_connection System_PLL.reset_source m3_arb_lat_count_low.reset reset
add_connection System_PLL.reset_source m3_arb_lat_sum_high.reset reset
add_connection System_PLL.reset_source m3_arb_lat_sum_low.reset reset
add_connection System_PLL.reset_source m3_arb_lat_sum_ovrflw.reset reset
add_connection System_PLL.reset_source m3_fifo_lat_count_high.reset reset
add_connection System_PLL.reset_source m3_fifo_lat_count_low.reset reset
add_connection System_PLL.reset_source m3_fifo_lat_sum_high.reset reset
add_connection System_PLL.reset_source m3_fifo_lat_sum_low.reset reset
add_connection System_PLL.reset_source m3_fifo_lat_sum_ovrflw.reset reset
add_connection System_PLL.reset_source m3_issue_gap_pio.reset reset
add_connection System_PLL.reset_source m3_max_lat.reset reset
add_connection System_PLL.reset_source m3_max_lat_arb.reset reset
add_connection System_PLL.reset_source m3_min_lat.reset reset
add_connection System_PLL.reset_source m3_min_lat_arb.reset reset
add_connection System_PLL.reset_source m3_service_count_pio.reset reset
add_connection System_PLL.reset_source mem_delay_cycle_pio.reset reset
add_connection System_PLL.reset_source pipeline_design_pio.reset reset
add_connection System_PLL.reset_source Pixel_DMA_Addr_Translation.reset reset
add_connection System_PLL.reset_source pll_50MHz.reset reset
add_connection System_PLL.reset_source reset_controller_50MHz.reset_in0 reset
add_connection System_PLL.reset_source reset_controller_100MHz.reset_in0 reset
add_connection System_PLL.reset_source reset_pio.reset reset
add_connection System_PLL.reset_source SDRAM.reset reset
add_connection System_PLL.reset_source VGA_Subsystem.sys_reset reset
add_connection ARM_A9_HPS.h2f_axi_master fifo_abLat0.in_csr avalon
set_connection_parameter_value ARM_A9_HPS.h2f_axi_master/fifo_abLat0.in_csr baseAddress 0x04000120
add_connection ARM_A9_HPS.h2f_axi_master fifo_abLat0.out avalon
set_connection_parameter_value ARM_A9_HPS.h2f_axi_master/fifo_abLat0.out baseAddress 0x04000100
add_connection ARM_A9_HPS.h2f_axi_master fifo_abLat1.in_csr avalon
set_connection_parameter_value ARM_A9_HPS.h2f_axi_master/fifo_abLat1.in_csr baseAddress 0x04000160
add_connection ARM_A9_HPS.h2f_axi_master fifo_abLat1.out avalon
set_connection_parameter_value ARM_A9_HPS.h2f_axi_master/fifo_abLat1.out baseAddress 0x04000140
add_connection ARM_A9_HPS.h2f_axi_master fifo_abLat2.in_csr avalon
set_connection_parameter_value ARM_A9_HPS.h2f_axi_master/fifo_abLat2.in_csr baseAddress 0x040001a0
add_connection ARM_A9_HPS.h2f_axi_master fifo_abLat2.out avalon
set_connection_parameter_value ARM_A9_HPS.h2f_axi_master/fifo_abLat2.out baseAddress 0x04000180
add_connection ARM_A9_HPS.h2f_axi_master fifo_abLat3.in_csr avalon
set_connection_parameter_value ARM_A9_HPS.h2f_axi_master/fifo_abLat3.in_csr baseAddress 0x040001e0
add_connection ARM_A9_HPS.h2f_axi_master fifo_abLat3.out avalon
set_connection_parameter_value ARM_A9_HPS.h2f_axi_master/fifo_abLat3.out baseAddress 0x040001c0
add_connection ARM_A9_HPS.h2f_axi_master fifo_fLat0.in_csr avalon
set_connection_parameter_value ARM_A9_HPS.h2f_axi_master/fifo_fLat0.in_csr baseAddress 0x04000020
add_connection ARM_A9_HPS.h2f_axi_master fifo_fLat0.out avalon
set_connection_parameter_value ARM_A9_HPS.h2f_axi_master/fifo_fLat0.out baseAddress 0x04000000
add_connection ARM_A9_HPS.h2f_axi_master fifo_fLat1.in_csr avalon
set_connection_parameter_value ARM_A9_HPS.h2f_axi_master/fifo_fLat1.in_csr baseAddress 0x04000060
add_connection ARM_A9_HPS.h2f_axi_master fifo_fLat1.out avalon
set_connection_parameter_value ARM_A9_HPS.h2f_axi_master/fifo_fLat1.out baseAddress 0x04000040
add_connection ARM_A9_HPS.h2f_axi_master fifo_fLat2.in_csr avalon
set_connection_parameter_value ARM_A9_HPS.h2f_axi_master/fifo_fLat2.in_csr baseAddress 0x040000a0
add_connection ARM_A9_HPS.h2f_axi_master fifo_fLat2.out avalon
set_connection_parameter_value ARM_A9_HPS.h2f_axi_master/fifo_fLat2.out baseAddress 0x04000080
add_connection ARM_A9_HPS.h2f_axi_master fifo_fLat3.in_csr avalon
set_connection_parameter_value ARM_A9_HPS.h2f_axi_master/fifo_fLat3.in_csr baseAddress 0x040000e0
add_connection ARM_A9_HPS.h2f_axi_master fifo_fLat3.out avalon
set_connection_parameter_value ARM_A9_HPS.h2f_axi_master/fifo_fLat3.out baseAddress 0x040000c0
add_connection ARM_A9_HPS.h2f_axi_master SDRAM.s1 avalon
set_connection_parameter_value ARM_A9_HPS.h2f_axi_master/SDRAM.s1 baseAddress 0x0000
add_connection ARM_A9_HPS.h2f_axi_master VGA_Subsystem.char_buffer_slave avalon
set_connection_parameter_value ARM_A9_HPS.h2f_axi_master/VGA_Subsystem.char_buffer_slave baseAddress 0x09000000
add_connection ARM_A9_HPS.h2f_lw_axi_master addr_gen_mode_pio.s1 avalon
set_connection_parameter_value ARM_A9_HPS.h2f_lw_axi_master/addr_gen_mode_pio.s1 baseAddress 0x30a0
add_connection ARM_A9_HPS.h2f_lw_axi_master arb_mode_pio.s1 avalon
set_connection_parameter_value ARM_A9_HPS.h2f_lw_axi_master/arb_mode_pio.s1 baseAddress 0x3090
add_connection ARM_A9_HPS.h2f_lw_axi_master data_requested_pio.s1 avalon
set_connection_parameter_value ARM_A9_HPS.h2f_lw_axi_master/data_requested_pio.s1 baseAddress 0x34e0
add_connection ARM_A9_HPS.h2f_lw_axi_master m0_arb_lat_count_high.s1 avalon
set_connection_parameter_value ARM_A9_HPS.h2f_lw_axi_master/m0_arb_lat_count_high.s1 baseAddress 0x3340
add_connection ARM_A9_HPS.h2f_lw_axi_master m0_arb_lat_count_low.s1 avalon
set_connection_parameter_value ARM_A9_HPS.h2f_lw_axi_master/m0_arb_lat_count_low.s1 baseAddress 0x3350
add_connection ARM_A9_HPS.h2f_lw_axi_master m0_arb_lat_sum_high.s1 avalon
set_connection_parameter_value ARM_A9_HPS.h2f_lw_axi_master/m0_arb_lat_sum_high.s1 baseAddress 0x3320
add_connection ARM_A9_HPS.h2f_lw_axi_master m0_arb_lat_sum_low.s1 avalon
set_connection_parameter_value ARM_A9_HPS.h2f_lw_axi_master/m0_arb_lat_sum_low.s1 baseAddress 0x3330
add_connection ARM_A9_HPS.h2f_lw_axi_master m0_arb_lat_sum_ovrflw.s1 avalon
set_connection_parameter_value ARM_A9_HPS.h2f_lw_axi_master/m0_arb_lat_sum_ovrflw.s1 baseAddress 0x3380
add_connection ARM_A9_HPS.h2f_lw_axi_master m0_fifo_lat_count_high.s1 avalon
set_connection_parameter_value ARM_A9_HPS.h2f_lw_axi_master/m0_fifo_lat_count_high.s1 baseAddress 0x3180
add_connection ARM_A9_HPS.h2f_lw_axi_master m0_fifo_lat_count_low.s1 avalon
set_connection_parameter_value ARM_A9_HPS.h2f_lw_axi_master/m0_fifo_lat_count_low.s1 baseAddress 0x3190
add_connection ARM_A9_HPS.h2f_lw_axi_master m0_fifo_lat_sum_high.s1 avalon
set_connection_parameter_value ARM_A9_HPS.h2f_lw_axi_master/m0_fifo_lat_sum_high.s1 baseAddress 0x3160
add_connection ARM_A9_HPS.h2f_lw_axi_master m0_fifo_lat_sum_low.s1 avalon
set_connection_parameter_value ARM_A9_HPS.h2f_lw_axi_master/m0_fifo_lat_sum_low.s1 baseAddress 0x3170
add_connection ARM_A9_HPS.h2f_lw_axi_master m0_fifo_lat_sum_ovrflw.s1 avalon
set_connection_parameter_value ARM_A9_HPS.h2f_lw_axi_master/m0_fifo_lat_sum_ovrflw.s1 baseAddress 0x31c0
add_connection ARM_A9_HPS.h2f_lw_axi_master m0_issue_gap_pio.s1 avalon
set_connection_parameter_value ARM_A9_HPS.h2f_lw_axi_master/m0_issue_gap_pio.s1 baseAddress 0x30d0
add_connection ARM_A9_HPS.h2f_lw_axi_master m0_max_lat.s1 avalon
set_connection_parameter_value ARM_A9_HPS.h2f_lw_axi_master/m0_max_lat.s1 baseAddress 0x31b0
add_connection ARM_A9_HPS.h2f_lw_axi_master m0_max_lat_arb.s1 avalon
set_connection_parameter_value ARM_A9_HPS.h2f_lw_axi_master/m0_max_lat_arb.s1 baseAddress 0x3370
add_connection ARM_A9_HPS.h2f_lw_axi_master m0_min_lat.s1 avalon
set_connection_parameter_value ARM_A9_HPS.h2f_lw_axi_master/m0_min_lat.s1 baseAddress 0x31a0
add_connection ARM_A9_HPS.h2f_lw_axi_master m0_min_lat_arb.s1 avalon
set_connection_parameter_value ARM_A9_HPS.h2f_lw_axi_master/m0_min_lat_arb.s1 baseAddress 0x3360
add_connection ARM_A9_HPS.h2f_lw_axi_master m0_service_count_pio.s1 avalon
set_connection_parameter_value ARM_A9_HPS.h2f_lw_axi_master/m0_service_count_pio.s1 baseAddress 0x3120
add_connection ARM_A9_HPS.h2f_lw_axi_master m1_arb_lat_count_high.s1 avalon
set_connection_parameter_value ARM_A9_HPS.h2f_lw_axi_master/m1_arb_lat_count_high.s1 baseAddress 0x33b0
add_connection ARM_A9_HPS.h2f_lw_axi_master m1_arb_lat_count_low.s1 avalon
set_connection_parameter_value ARM_A9_HPS.h2f_lw_axi_master/m1_arb_lat_count_low.s1 baseAddress 0x33c0
add_connection ARM_A9_HPS.h2f_lw_axi_master m1_arb_lat_sum_high.s1 avalon
set_connection_parameter_value ARM_A9_HPS.h2f_lw_axi_master/m1_arb_lat_sum_high.s1 baseAddress 0x3390
add_connection ARM_A9_HPS.h2f_lw_axi_master m1_arb_lat_sum_low.s1 avalon
